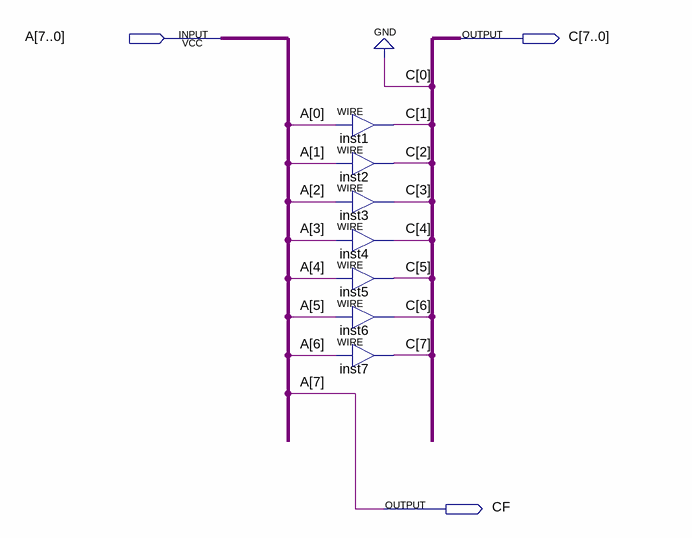
[diagram p0: schematic sheet]
// Quartus schematic SHL_8R.bdf as structural Verilog: 7 symbols, 3 pins
module SHL_8R (
  input  [7:0] A,
  output [7:0] C,
  output CF
);

  assign C[1] = A[0];  // WIRE inst1
  assign C[2] = A[1];  // WIRE inst2
  assign C[3] = A[2];  // WIRE inst3
  assign C[4] = A[3];  // WIRE inst4
  assign C[5] = A[4];  // WIRE inst5
  assign C[6] = A[5];  // WIRE inst6
  assign C[7] = A[6];  // WIRE inst7

  assign C[0] = 1'b0;
  assign CF = A[7];
endmodule
